# Altium schematic sheet Peripherals.SchDoc: Peripherals
size 431 x 279 mm; DrawnBy: DD; DocumentNumber: GHL-1-21002; Revision: A; SheetNumber: 6; SheetTotal: 7; ProjectID: 263-03
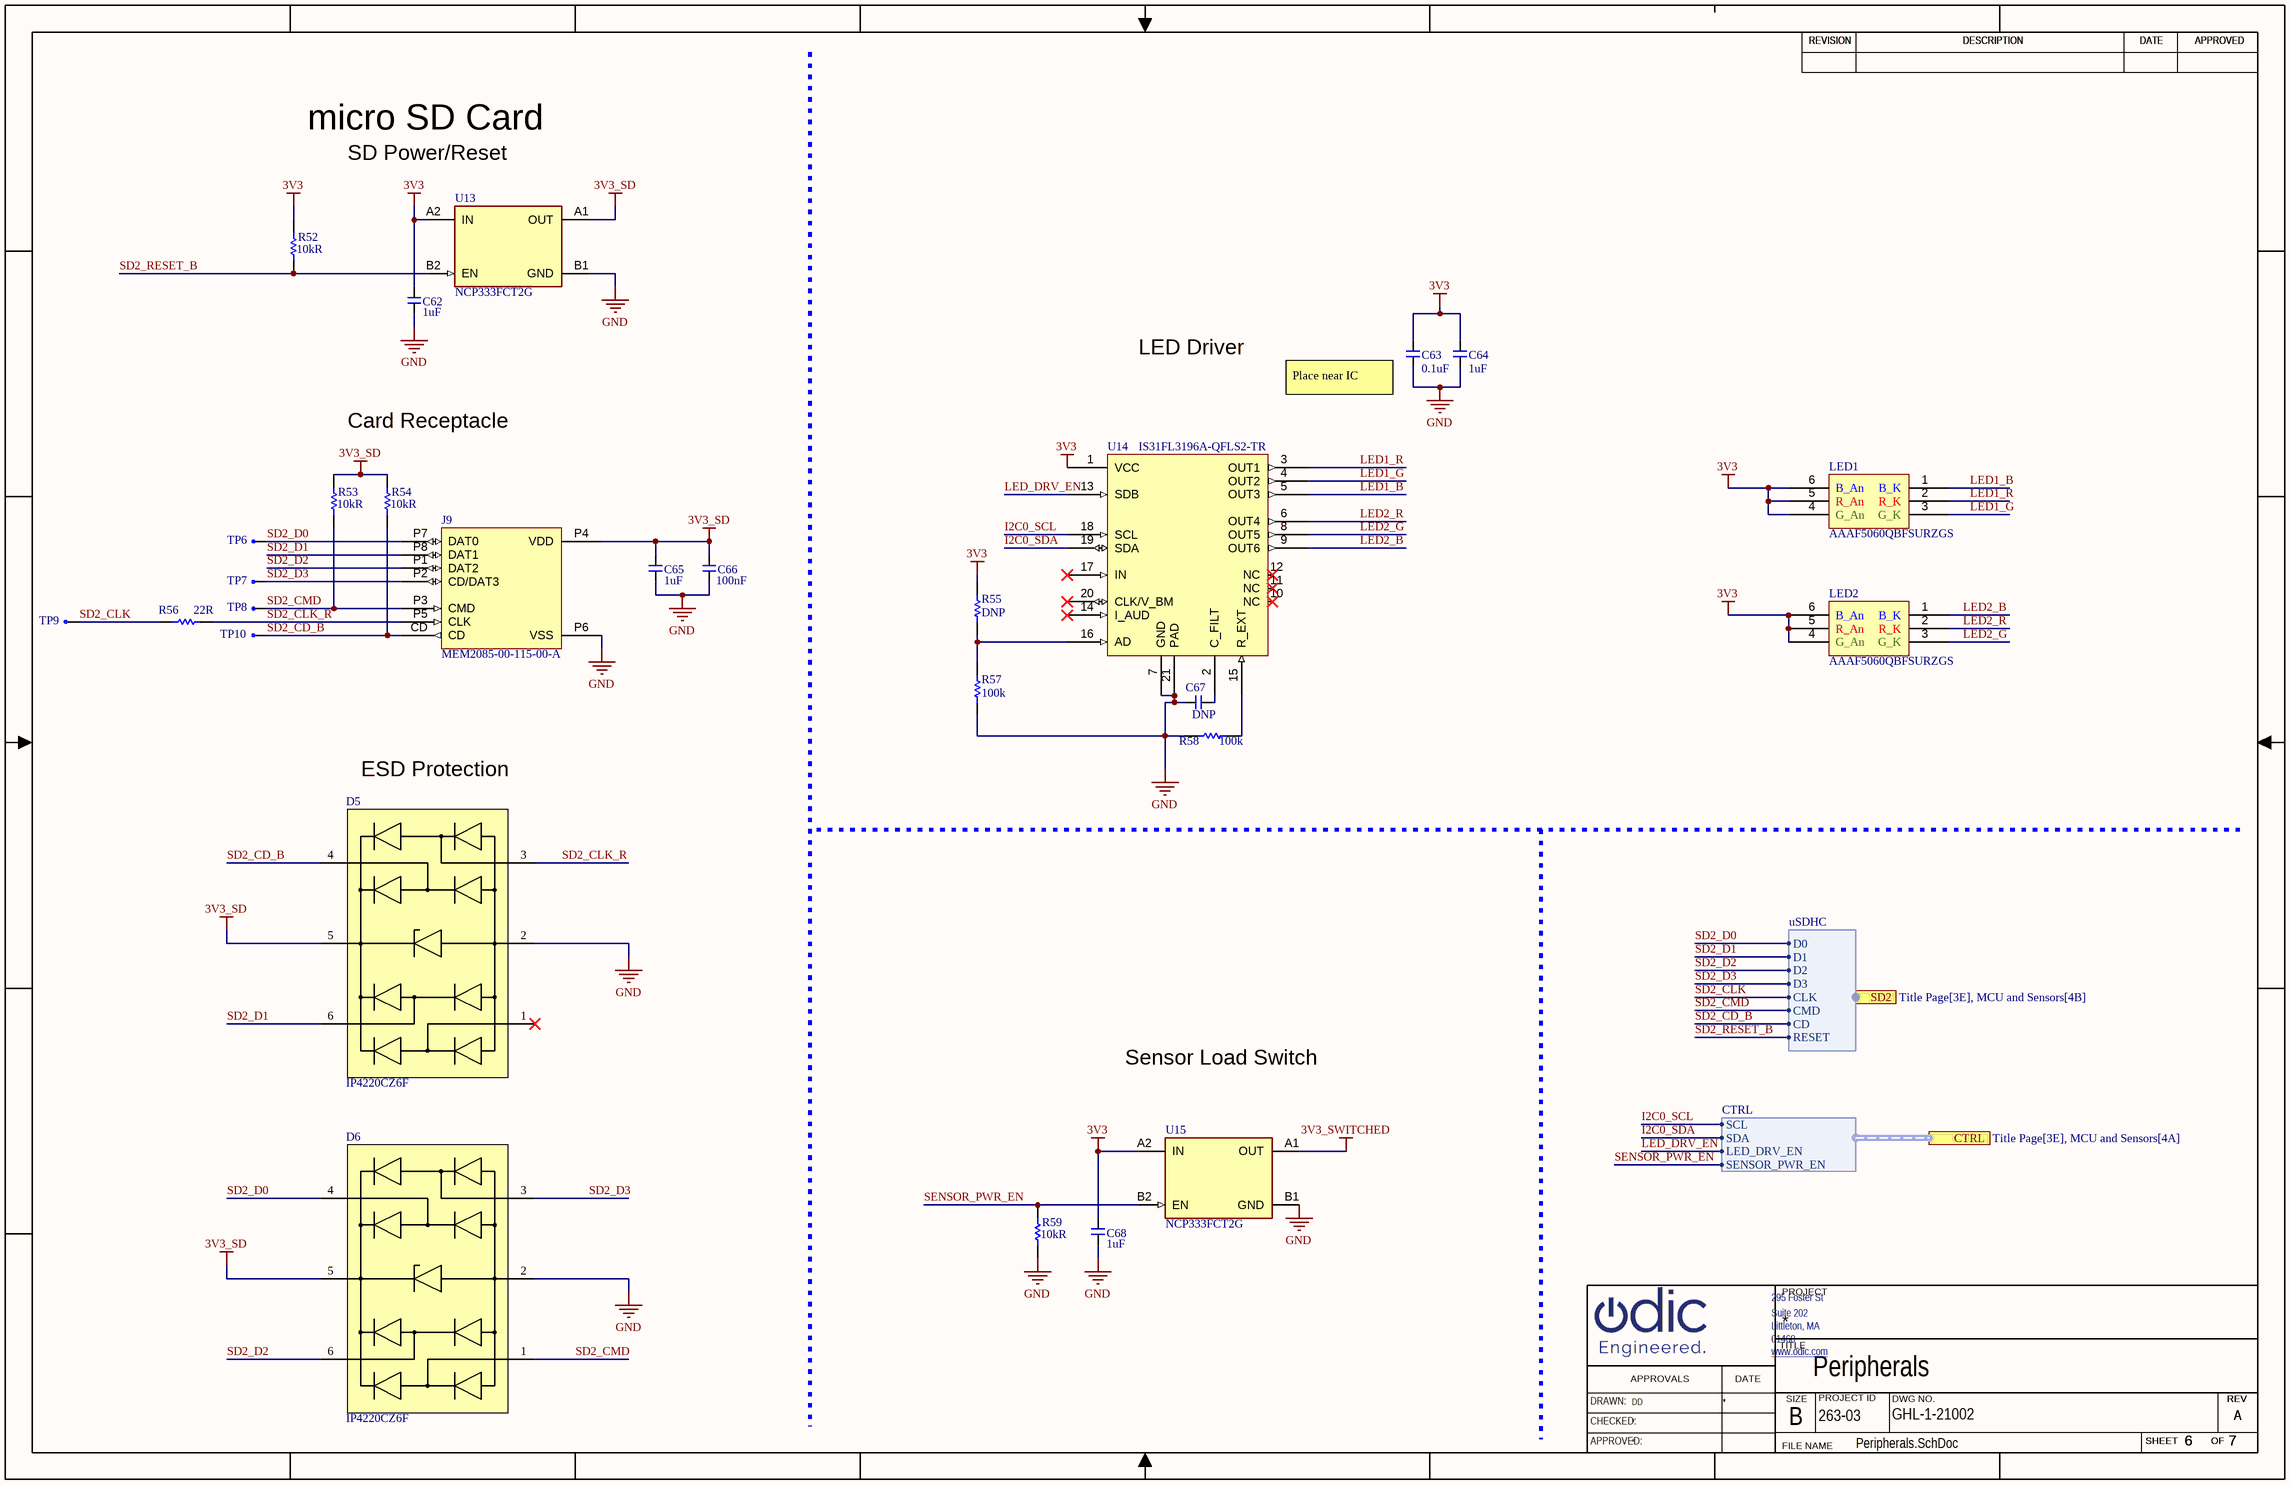
[diagram p0: Peripherals.SchDoc]

## Parts
C62  Capacitance: 1uF  [C0402]  (hidden comment: C0402_1u_6V3_10pct)
C63  0.1uF  [C0402]
C64  1uF  [C0402]
C65  Capacitance: 1uF  [C0402]  (hidden comment: C0402_1u_6V3_10pct)
C66  value 100nF  [C0402]  (hidden comment: C0402_0u1_16V_10pct)
C67  Install: DNP  [C0603]  (hidden comment: N/A)
C68  Capacitance: 1uF  [C0402]  (hidden comment: C0402_1u_6V3_10pct)
D5  IP4220CZ6F  [SOT23-6PIN]
D6  IP4220CZ6F  [SOT23-6PIN]
J9  MEM2085-00-115-00-A  [GCT_MEM2085-00-115-00-A_REV0.2]
LED1  AAAF5060QBFSURZGS  [led6_smt_5x6mm]
LED2  AAAF5060QBFSURZGS  [led6_smt_5x6mm]
R52  Resistance: 10kR  [R0402]  (hidden comment: R0402_10k_1pct)
R53  Resistance: 10kR  [R0402]  (hidden comment: R0402_10k_1pct)
R54  Resistance: 10kR  [R0402]  (hidden comment: R0402_10k_1pct)
R55  DNP  [R0402]
R56  Resistance: 22R  [R0402]  (hidden comment: R0402_22R_1pct)
R57  100k  [R0402]
R58  100k  [R0402]
R59  Resistance: 10kR  [R0402]  (hidden comment: R0402_10k_1pct)
TP6  TPC30  [tpc30]  (value not drawn)
TP7  TPC30  [tpc30]  (value not drawn)
TP8  TPC30  [tpc30]  (value not drawn)
TP9  TPC30  [tpc30]  (value not drawn)
TP10  TPC30  [tpc30]  (value not drawn)
U13  NCP333FCT2G  [bga4_p743xp743_p4mm]
U14  IS31FL3196A-QFLS2-TR  [qfn20_3x3_p4mm]
U15  NCP333FCT2G  [bga4_p743xp743_p4mm]

## Ports
CTRL (harness CTRL, see Title Page[3E], MCU and Sensors[4A]), SD2 (harness uSDHC, see Title Page[3E], MCU and Sensors[4B])

## Harnesses
CTRL: SCL, SDA, LED_DRV_EN, SENSOR_PWR_EN
uSDHC: D0, D1, D2, D3, CLK, CMD, CD, RESET

## Nets
3V3: C62.2 C63.2 C64.2 C68.2 LED1.4(G_An) LED1.5(R_An) LED1.6(B_An) LED2.4(G_An) LED2.5(R_An) LED2.6(B_An) R52.1 R55.2 U13.A2(IN) U14.1(VCC) U15.A2(IN)
3V3_SD: C65.2 C66.2 D5.5(VP) D6.5(VP) J9.P4(VDD) R53.1 R54.1 U13.A1(OUT)
3V3_SWITCHED: U15.A1(OUT)
GND: C62.1 C63.1 C64.1 C65.1 C66.1 C67.2 C68.1 D5.2(GND) D6.2(GND) J9.P6(VSS) R57.1 R58.2 R59.2 U13.B1(GND) U14.7(GND) U14.21(PAD) U15.B1(GND)
I2C0_SCL: U14.18(SCL) ; port CTRL.SCL
I2C0_SDA: U14.19(SDA) ; port CTRL.SDA
LED1_B: LED1.1(B_K) U14.5(OUT3)
LED1_G: LED1.3(G_K) U14.4(OUT2)
LED1_R: LED1.2(R_K) U14.3(OUT1)
LED2_B: LED2.1(B_K) U14.9(OUT6)
LED2_G: LED2.3(G_K) U14.8(OUT5)
LED2_R: LED2.2(R_K) U14.6(OUT4)
LED_DRV_EN: U14.13(SDB) ; port CTRL.LED_DRV_EN
SD2_CD_B: D5.4(I/O3) J9.CD R54.2 TP10.1 ; port SD2.CD
SD2_CLK: R56.1 TP9.1 ; port SD2.CLK
SD2_CLK_R: D5.3(I/O2) J9.P5(CLK) R56.2
SD2_CMD: D6.1(I/O1) J9.P3(CMD) R53.2 TP8.1 ; port SD2.CMD
SD2_D0: D6.4(I/O3) J9.P7(DAT0) TP6.1 ; port SD2.D0
SD2_D1: D5.6(I/O4) J9.P8(DAT1) ; port SD2.D1
SD2_D2: D6.6(I/O4) J9.P1(DAT2) ; port SD2.D2
SD2_D3: D6.3(I/O2) J9.P2(CD/DAT3) TP7.1 ; port SD2.D3
SD2_RESET_B: R52.2 U13.B2(EN) ; port SD2.RESET
SENSOR_PWR_EN: R59.1 U15.B2(EN) ; port CTRL.SENSOR_PWR_EN
NetC67_1: C67.1 U14.2(C_FILT)
NetR55_1: R55.1 R57.2 U14.16(AD)
NetR58_1: R58.1 U14.15(R_EXT)

Not connected (* = marked no-connect by the designer): D5 1(I/O1)*; U14 10(NC)* 11(NC)* 12(NC)* 14(I_AUD)* 17(IN)* 20(CLK/V_BM)*

## Notes on the sheet
- micro SD Card
- SD Power/Reset
- LED Driver
- Card Receptacle
- (near C63) Place near IC
- ESD Protection
- Sensor Load Switch
- REVISION
- DESCRIPTION
- DATE
- APPROVED
- 295 Foster St
- PROJECT
- www.odic.com <http://www.odic.com>
- Littleton, MA
- 01460
- Suite 202
- TITLE
- DRAWN:
- CHECKED:
- APPROVALS
- SIZE
- B
- PROJECT ID
- DWG NO.
- SHEET
- OF
- REV
- APPROVED:
- FILE NAME

## Library data of the parts
C62 C65 C68 = CMP-00342-1: Cap Ceramic 1uF 6.3V X5R 10% SMD 0402 85C Paper T/R; Install: POP; Max Operating Temperature: 85°C; RoHS Compliant: Yes; Number of Pins: 2; Packaging: Tape and Reel; Thickness: 0.022inch; Lead Free: Lead Free; Package Quantity: 10000; Tolerance: 10%; Height: 0.5mm; Depth: 0.5mm; Construction: Flat; Radiation Hardening: No; REACH SVHC: No SVHC; Dielectric: X5R; Resistor Type: Ceramic; Min Operating Temperature: -55°C; Series: M; Width: 0.5mm; Case/Package: 0402; Voltage Rating: 6.3V; Case Code (Imperial): 0402; Length: 1mm; Voltage Rating (DC): 6.3V; Halogen Free: Halogen Free; Termination: SMD/SMT; Mount: Surface Mount; Case Code (Metric): 1005
C63 = CMP-00369-1: Cap Ceramic 0.1uF 25V X5R 10% Pad SMD 0402 Multi Layer Ceramic Capacitor (MLCC); Capacitance: 100nF; Install: POP; Packaging: Tape and Reel; Construction: Flat; Max Operating Temperature: 85°C; Case Code (Metric): 1005; Voltage Rating (DC): 25V; Min Operating Temperature: -55°C; Height: 0.5mm; Series: CL; Case/Package: 0402; Voltage: 25V; Package Quantity: 1; Radiation Hardening: No; Depth: 0.5mm; Thickness: 0.022inch; Lead Free: Lead Free; Tolerance: 10%; Length: 1mm; Mount: Surface Mount; Width: 0.02inch; Dielectric: X5R; RoHS Compliant: Yes; Voltage Rating: 25V; Case Code (Imperial): 0402
C64 = CMP-00317-1: CAP CER 1UF 16V X5R 0402; Install: POP; Tolerance: 10%; Thickness: 0.022inch; Radiation Hardening: No; Voltage Rating: 16V; Length: 1mm; Voltage: 16V; Capacitance: 1uF; Dielectric: X5R; Packaging: Tape and Reel; Contact Plating: Tin; Min Operating Temperature: -55°C; Series: CL; Depth: 0.5mm; Case Code (Imperial): 0402; Case Code (Metric): 1005; Package Quantity: 1; RoHS Compliant: Yes; Height: 0.5mm; Mount: Surface Mount; Max Operating Temperature: 85°C; Case/Package: 0402; Width: 0.02inch; Construction: Flat
C66 = CMP-00446-1: Ceramic capacitor SMD 0402 100nF 16V X7R 10%; Install: POP; Voltage: 16V; Mounting Technology: Surface Mount; Width: 0.02inch; Case Code (Metric): 1005; Package Quantity: 1; Depth: 0.5mm; RoHS Compliant: Yes; Length: 1mm; Tolerance: 10%; Radiation Hardening: No; Contact Plating: Tin; Packaging: Tape and Reel; Voltage Rating (DC): 16V; Thickness: 0.022inch; Case Code (Imperial): 0402; Case/Package: 0402; Min Operating Temperature: -55°C; Max Operating Temperature: 125°C; Voltage Rating: 16V; Height: 0.5mm; Series: CL; Material: Ceramic; Construction: Flat; Lead Free: Lead Free; Dielectric: X7R
C67 = CMP-00018-1: DNP CAP; Manufacturer: Samsung; Manufacturer Part Number: CL10B104KB8NNWC; Value: .1uF; Tolerance: 10%; Voltage Rating: 50V; Dielectric: X7R; Odic Footprint: C0603; ComponentLink1URL: https://datasheet.ciiva.com/6277/s0717e-6277799.pdf?src-supplier=Digi-Key; ComponentLink1Description: https://datasheet.ciiva.com/6277/s0717e-6277799.pdf?src-supplier=Digi-Key; ComponentLink2URL: https://datasheet.ciiva.com/6277/s0717e-6277800.pdf?src-supplier=Digi-Key; ComponentLink2Description: https://datasheet.ciiva.com/6277/s0717e-6277800.pdf?src-supplier=Digi-Key; ComponentLink3URL: https://datasheet.ciiva.com/6277/s0717e-6277801.pdf?src-supplier=Digi-Key; ComponentLink3Description: https://datasheet.ciiva.com/6277/s0717e-6277801.pdf?src-supplier=Digi-Key; Supplier 1: Digi-Key; Supplier Part Number 1: 1276-1935-1-ND; RoHS: Yes; Category: Ceramic Capacitors; Stock 1: 1643; Pricing 1: 1=0.10000, 10=0.02000, 50=0.01100, 100=0.00910, 500=0.00646, 1000=0.00508 (USD); Mount: Surface Mount; Case/Package: 0603; Case Code (Metric): 1608; Case Code (Imperial): 0603; Contact Plating: Tin; Min Operating Temperature: -55°C; Max Operating Temperature: 125°C; Package Quantity: 1; Packaging: Cut Tape; Termination: Wraparound; Series: CL; Construction: Flat; Length: 0.063inch; Width: 0.031inch; Thickness: 0.035inch; RoHS Compliant: Yes; ComponentLink4URL: https://datasheet.ciiva.com/25740/cl10b104kb8nnwc-25740227.pdf?src-supplier=Digi-Key; ComponentLink4Description: https://datasheet.ciiva.com/25740/cl10b104kb8nnwc-25740227.pdf?src-supplier=Digi-Key
D5 D6 = CMP-00550-6: IC USB DUAL ESD PROTEC 6TSOP; RoHS Compliant: Yes
J9 = CMP-00549-5: 9 (8 + 1) Position Secure Digital microSD SMT Right Angle Card Connector; Install: POP
LED1 LED2 = CMP-00100-4: Blue/Red/Green 100º 400/800/1000 mcd Clear Surface Mount LED Lamp; Dominant Wavelength: 465nm; Viewing Angle: 100°; Test Current: 30mA; Forward Voltage: 3.3V; Color: Blue,Green,Red; Luminous Intensity: 400mcd; Install: POP; Forward Current: 20mA; Packaging: Cut Tape; Lens Style: Clear; Package Quantity: 500; Min Operating Temperature: -40°C; RoHS Compliant: Yes; Height: 2.3mm; Case/Package: SMD/SMT; Lens Color: Clear; Width: 6mm; Max Operating Temperature: 85°C; Lead Free: Lead Free; Illumination Color: Blue,Green,Red; Mount: Surface Mount; Length: 5mm
R52-R54 R59 = CMP-00352-1: Res Thick Film 0402 10K Ohm 1% 1/16W ±100ppm/°C Molded SMD SMD T/R; Max Power Dissipation: 63mW; Install: POP; RoHS Compliant: Yes; Number of Terminations: 2; Case/Package: 0402; Case Code (Metric): 1005; Length: 0.039inch; Military Standard: Not; Size Code: 0402; Series: RC; Height: 0.016inch; Contact Plating: Tin; Features: Moisture Resistant; Width: 0.02inch; Mount: Surface Mount; Temperature Coefficient: 100ppm/°C; Package Quantity: 1; Resistor Type: Thick Film; Min Operating Temperature: -55°C; Max Operating Temperature: 155°C; Power Rating: 63mW; Tolerance: 1%; Depth: 0.5mm; Case Code (Imperial): 0402; Construction: Rectangular; Packaging: Tape and Reel; Radiation Hardening: No
R55 = CMP-00015-3: Unpopulated 0402 pads. No part number associated with this "component"; Install: DNP; Odic Footprint: R0402
R56 = CMP-00723-1: Res SMD 22 Ohm 1% 1/16W 0402; Install: POP; RoHS Compliant: Yes
R57 R58 = CMP-00351-1: Res General Purpose Thick Film 0402 100K Ohm 1% 1/16W ±100ppm/°C Molded SMD Paper T/R; Working Voltage: 50V; Resistance: 100kR; Install: POP; Power Rating: 63mW; Series: RC; Military Standard: Not; Case Code (Metric): 1005; Features: Moisture Resistant; Termination: SMD/SMT; Number of Terminations: 2; Temperature Coefficient: 100ppm/°C; Height: 0.016inch; Tolerance: 1%; Case/Package: 0402; Depth: 0.5mm; RoHS Compliant: Yes; Resistance Tolerance: 1%; Lead Free: Lead Free; Max Operating Temperature: 155°C; Min Operating Temperature: -55°C; Width: 0.02inch; Packaging: Tape and Reel; Technology: THICK FILM; Case Code (Imperial): 0402; Package Quantity: 1; REACH SVHC: No SVHC; Resistor Type: Thick Film; Max Power Dissipation: 63mW; Voltage Rating: 50V; Length: 0.039inch; Construction: Rectangular
TP6-TP10 = CMP-00021-3: Test Point Circle 30; Install: DNP
U13 = CMP-00215-5: IC LOAD SWITCH W/DIS 1.5A 4WLCSP; Interface: On/Off; On-State Resistance: 400mR; Install: POP; Output Configuration: High Side; Max Power Dissipation: 400mW; Operating Supply Voltage: 5.5V; Turn-On Delay Time: 195us; Number of Outputs: 1; Max Operating Temperature: 85°C; Series: -; Max Output Current: 1.5A; Number of Pins: 4; Halogen Free: Halogen Free; RoHS Compliant: Yes; Output Current: 1.5A; Mount: Surface Mount; Min Operating Temperature: -40°C; Packaging: Tape and Reel; Lead Free: Lead Free; Package Quantity: 3000; Power Dissipation: 400mW; Max Supply Current: 1.5A
U14 = CMP-00912-2: 6-Channel Light Effect LED Driver with I2C Interface 2.7V to 5.5V Input 20-Pin QFN T/R; Install: POP; Dimming: I²C; Output Current per Channel: 40mA; Number of Outputs: 6; Max Operating Temperature: 85°C; Case/Package: QFN; Mounting Technology: Surface Mount; Min Operating Temperature: -40°C; Max Supply Voltage: 5.5V; Packaging: Cut Tape; RoHS Compliant: Yes; Series: -
U15 = CMP-00215-5: IC LOAD SWITCH W/DIS 1.5A 4WLCSP; On-State Resistance: 400mR; Turn-On Delay Time: 195us; Install: POP; Power Dissipation: 400mW; Number of Outputs: 1; Output Configuration: High Side; Operating Supply Voltage: 5.5V; Interface: On/Off; Packaging: Tape and Reel; Max Supply Current: 1.5A; Number of Pins: 4; Package Quantity: 3000; Max Operating Temperature: 85°C; RoHS Compliant: Yes; Min Operating Temperature: -40°C; Lead Free: Lead Free; Output Current: 1.5A; Max Power Dissipation: 400mW; Mount: Surface Mount; Series: -; Max Output Current: 1.5A; Halogen Free: Halogen Free